# EAGLE board Atx_psu (EAGLE 5.10)
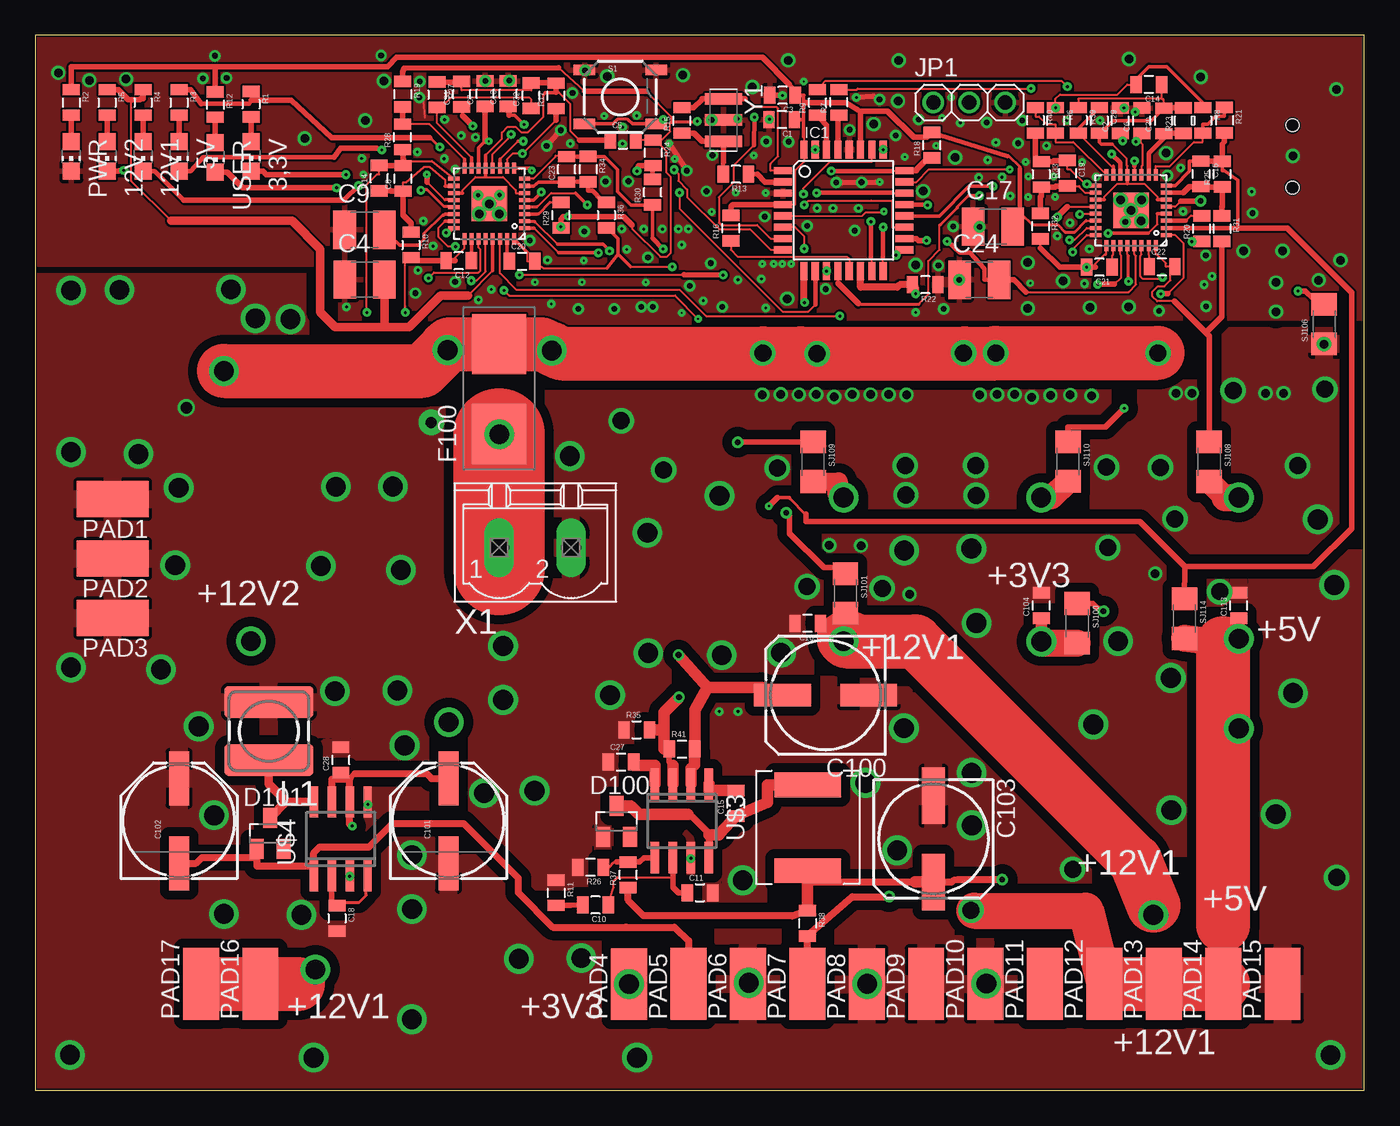
[diagram p6: board, top side]
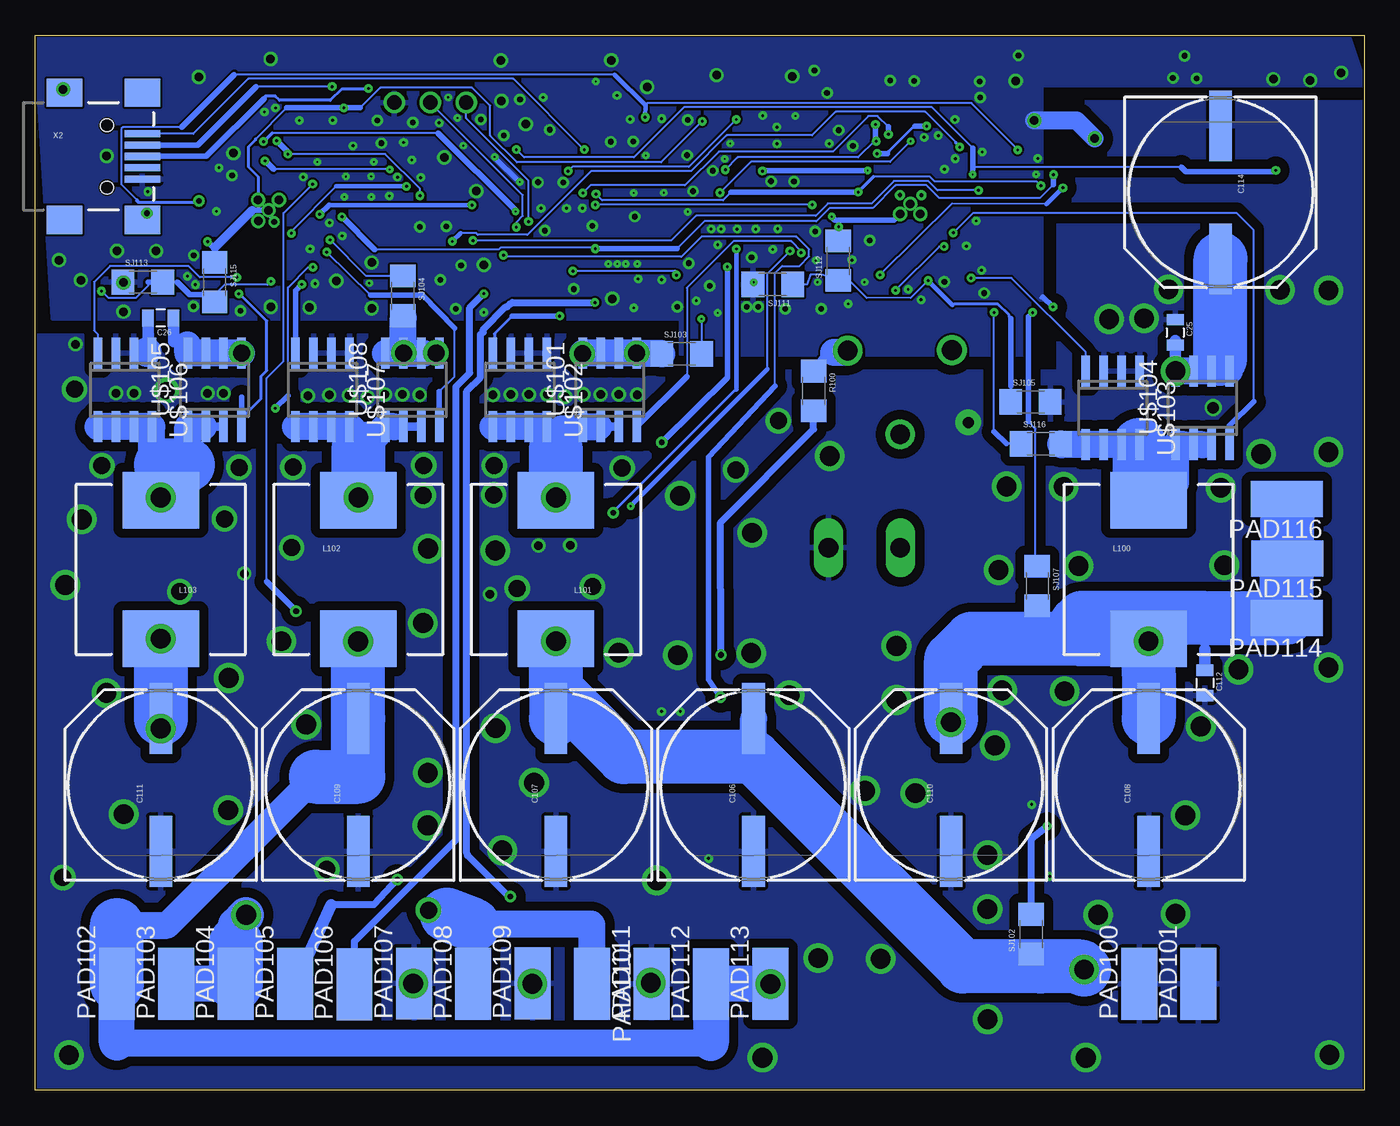
[diagram p7: board, bottom side, seen from below]

Size 93.96 x 74.6 mm. Coordinates in mm from the lower left corner, seen from the top.
Outline: 0,0 93.96,0 93.96,74.6 0,74.6 0,0
Copper layers (1*16): Top 0.035mm / dielectric 1.5mm / Bottom 0.035mm
Design rules "default *": minimum track width 0.2mm, minimum drill 0.2mm, track to track 5mil, track to pad 5mil, pad to pad 5mil, via to via 5mil, smd to smd 5mil, copper to edge 5mil, drill to drill 8mil, minimum pad ring 10mil, minimum via ring 8mil, stop-mask expansion 4mil, vias tented up to drill 0mil, thermal gap 10mil
Net classes: 0 default: width 0.152 mm, drill 0.152 mm, clearance 0.152 mm; 1 power: width 1.905 mm, drill 0.508 mm, clearance 0.66 mm; 2 somepower: width 0.508 mm, drill 0.305 mm, clearance 0.254 mm

## Footprints (pad centres in the part's own frame; a part is rotated, then mirrored left to right if it is on the bottom)
CHIP-LED0805 = smd 1.2 x 1.2: A 0,-1.05; C 0,1.05
0805 = smd 0.8 x 1.2: 1 -0.9,0; 2 0.9,0
C1210 = smd 1.6 x 2.7: 1 -1.4,0; 2 1.4,0
153CLV-0807 = smd 4 x 1.6: + 3.05,0; - -3.05,0
PANASONIC_E = smd 3.8 x 1.4: + 3,0; - -3,0
PANASONIC_H13 = smd 5 x 1.6: + 4.7,0; - -4.7,0
SOT23 = smd 1 x 1.4: 1 -0.95,-1.1; 2 0.95,-1.1; 3 0,1.1
OMNI-BLOK = smd 4.24 x 3.81: 1 0,0; 2 6.37,0
TQFP32-08 = smd 1.27 x 0.508: 1 -4.293,2.8; 2 -4.293,2; 3 -4.293,1.2; 4 -4.293,0.4; 5 -4.293,-0.4; 6 -4.293,-1.2; 7 -4.293,-2; 8 -4.293,-2.8; 17 4.293,-2.8; 18 4.293,-2; 19 4.293,-1.2; 20 4.293,-0.4; 21 4.293,0.4; 22 4.293,1.2; 23 4.293,2; 24 4.293,2.8 | smd 0.508 x 1.27: 9 -2.8,-4.293; 10 -2,-4.293; 11 -1.2,-4.293; 12 -0.4,-4.293; 13 0.4,-4.293; 14 1.2,-4.293; 15 2,-4.293; 16 2.8,-4.293; 25 2.8,4.293; 26 2,4.293; 27 1.2,4.293; 28 0.4,4.293; 29 -0.4,4.293; 30 -1.2,4.293; 31 -2,4.293; 32 -2.8,4.293
1X03 = drill 1.016 round: 1 -2.54,0; 2 0,0; 3 2.54,0
POWER-CHOKE_WE-TPC = smd 6.3 x 2.2: 1 0,2.05; 2 0,-2.05
CDRH125 = smd 5.4 x 4: 1 0,4.9; 2 0,-4.9
SMD2,54-5,08 = smd 2.54 x 5.08: 1 0,0
1206 = smd 1.6 x 1.8: 1 -1.4,0; 2 1.4,0
TACTILE_SWITCH_SMD = smd 1.524 x 0.762: 1 -2.54,1.905; 2 2.54,1.905; 3 -2.54,-1.905; 4 2.54,-1.905
QFN-32 = smd 0.285 x 0.8: P$1 -1.75,-2.5; P$2 -1.25,-2.5; P$3 -0.75,-2.5; P$4 -0.25,-2.5; P$5 0.25,-2.5; P$6 0.75,-2.5; P$7 1.25,-2.5; P$8 1.75,-2.5; P$17 1.75,2.5; P$18 1.25,2.5; P$19 0.75,2.5; P$20 0.25,2.5; P$21 -0.25,2.5; P$22 -0.75,2.5; P$23 -1.25,2.5; P$24 -1.75,2.5 | smd 0.8 x 0.285: P$9 2.5,-1.75; P$10 2.5,-1.25; P$11 2.5,-0.75; P$12 2.5,-0.25; P$13 2.5,0.25; P$14 2.5,0.75; P$15 2.5,1.25; P$16 2.5,1.75; P$25 -2.5,1.75; P$26 -2.5,1.25; P$27 -2.5,0.75; P$28 -2.5,0.25; P$29 -2.5,-0.25; P$30 -2.5,-0.75; P$31 -2.5,-1.25; P$32 -2.5,-1.75 | smd 2.5 x 2.5: P$33 0,0
SO8 = smd 0.6 x 2.2: 1 -1.905,-2.6; 2 -0.635,-2.6; 3 0.635,-2.6; 4 1.905,-2.6; 5 1.905,2.6; 6 0.635,2.6; 7 -0.635,2.6; 8 -1.905,2.6
CR75 = smd 1.75 x 4.7: P$1 0,0; P$2 6.05,0
MSTBV2 = drill 1.397 long: 1 -2.54,0; 2 2.54,0
USB-MINIB = smd 2.5 x 0.5: D+ 2.5,0; D- 2.5,0.8; GND 2.5,-1.6; ID 2.5,-0.8; VBUS 2.5,1.6 | smd 2.5 x 2: GND@1 -3,-4.5; GND@2 -3,4.5; GND@3 2.5,4.5; GND@4 2.5,-4.5 | hole 0.9: 0,2.2; 0,-2.2
CSTCR6M = smd 0.8 x 2.6: 1 -1.5,0; 2 0,0; 3 1.5,0

## Placement (x,y rotation side)
3,3V  YELLOW  [CHIP-LED0805]  15.27,66.04 180 top
5V  YELLOW  [CHIP-LED0805]  10.16,66.04 180 top
12V1  YELLOW  [CHIP-LED0805]  7.62,66.04 180 top
12V2  YELLOW  [CHIP-LED0805]  5.08,66.04 180 top
C1  0,1  [0805]  52.78,68.64 180 top
C2  0,1  [0805]  76.71,68.56 90 top
C3  1u  [0805]  52.84,70.35 180 top
C4  10u  [C1210]  23.28,57.33 0 top
C5  220n  [0805]  41.55,67.19 0 top
C6  0,1  [0805]  78.22,68.56 90 top
C7  0,1  [0805]  31.81,70.47 90 top
C8  0.1  [0805]  26,64.48 90 top
C9  10u  [C1210]  23.27,60.85 0 top
C10  180pF  [0805]  39.6,13.11 180 top
C11  12pF  [0805]  46.99,13.97 0 top
C12  0,1u  [0805]  29.94,58.65 180 top
C13  0,1  [0805]  33.43,70.47 90 top
C14  220n  [0805]  78.74,71.12 180 top
C15  0.1  [0805]  49.53,20.29 90 top
C16  0,1u  [0805]  82.43,64.8 270 top
C17  10uF/6.3V  [C1210]  67.71,61.08 0 top
C18  0,1  [0805]  21.33,12.15 270 top
C19  0,1u  [0805]  72.99,64.85 270 top
C20  0,1u  [0805]  34.41,58.63 0 top
C21  0,1u  [0805]  75.24,58.2 180 top
C22  0,1u  [0805]  79.67,58.24 0 top
C23  0.1  [0805]  37.57,65.12 90 top
C24  10u  [C1210]  66.75,57.31 0 top
C25  0,1u  [0805]  13.36,53.59 270 bottom
C26  220n  [0805]  85.09,54.61 180 bottom
C27  15nF  [0805]  41.41,23.22 0 top
C28  0,1  [0805]  21.6,23.35 90 top
C29  220pF  [0805]  75.23,68.58 270 top
C30  100pF  [0805]  79.78,68.55 90 top
C31  100pf  [0805]  30.15,70.44 90 top
C32  100pf  [0805]  35.05,70.34 90 top
C100  10uF/25V  [153CLV-0807]  55.88,27.94 180 top
C101  68uF/16V  [PANASONIC_E]  29.21,19.05 90 top
C102  68uF/16V  [PANASONIC_E]  10.16,19.05 90 top
C103  47uF/6.3V  [153CLV-0807]  63.5,17.78 270 top
C104  220n  [0805]  71.12,34.29 90 top
C105  220n  [0805]  54.61,33.02 180 top
C106  470u/16V  [PANASONIC_H13]  43.18,21.59 90 bottom
C107  470u/16V  [PANASONIC_H13]  57.15,21.59 90 bottom
C108  470u/16V  [PANASONIC_H13]  15.24,21.59 90 bottom
C109  470u/6.3V  [PANASONIC_H13]  71.12,21.59 90 bottom
C110  470u/16V  [PANASONIC_H13]  29.21,21.59 90 bottom
C111  470u / 6.3V  [PANASONIC_H13]  85.09,21.59 90 bottom
C112  220n  [0805]  11.26,28.81 270 bottom
C113  220n  [0805]  85.09,34.29 90 top
C114  470u  [PANASONIC_H13]  10.16,63.5 270 bottom
D100  BAT54  [SOT23]  41.09,19.01 0 top
D101  SANYO - SBS005-TL-E  [SOT23]  16.6,18.17 0 top
F100  LF 154  [OMNI-BLOK]  32.79,46.39 90 top
IC1  ATMEGA8U2-TQFP  [TQFP32-08]  57.15,62.23 0 top
JP1  [1X03]  66.04,69.85 0 top
L1  47uH, 0.73A, Farnell 744062470  [POWER-CHOKE_WE-TPC]  16.51,25.4 180 top
L100  2,4uH, BOURNS - SRP1235-4R7M  [CDRH125]  15.24,36.83 0 bottom
L101  2,4uH, BOURNS - SRP1235-4R7M  [CDRH125]  57.15,36.83 180 bottom
L102  3,3uH, BOURNS - SRP1235-4R7M  [CDRH125]  71.12,36.83 0 bottom
L103  3,3uH, BOURNS - SRP1235-4R7M  [CDRH125]  85.09,36.83 180 bottom
PAD1  PGND  [SMD2,54-5,08]  5.47,41.8 90 top
PAD2  PGND  [SMD2,54-5,08]  5.47,37.6 90 top
PAD3  PGND  [SMD2,54-5,08]  5.47,33.4 90 top
PAD4  +3,3V  [SMD2,54-5,08]  41.98,7.51 0 top
PAD5  -12V  [SMD2,54-5,08]  46.2,7.52 0 top
PAD6  PGND  [SMD2,54-5,08]  50.39,7.52 0 top
PAD7  ~POWER_ON  [SMD2,54-5,08]  54.59,7.52 0 top
PAD8  PGND  [SMD2,54-5,08]  58.8,7.51 0 top
PAD9  GND  [SMD2,54-5,08]  62.99,7.52 0 top
PAD10  GND  [SMD2,54-5,08]  67.19,7.52 0 top
PAD11  RESERVED  [SMD2,54-5,08]  71.39,7.52 0 top
PAD12  +5V  [SMD2,54-5,08]  75.59,7.52 0 top
PAD13  +5V  [SMD2,54-5,08]  79.79,7.52 0 top
PAD14  +5V  [SMD2,54-5,08]  83.99,7.52 0 top
PAD15  PGND  [SMD2,54-5,08]  88.19,7.52 0 top
PAD16  +12V1  [SMD2,54-5,08]  15.91,7.52 0 top
PAD17  +12V1  [SMD2,54-5,08]  11.71,7.52 0 top
PAD100  PGND  [SMD2,54-5,08]  15.91,7.52 0 bottom
PAD101  PGND  [SMD2,54-5,08]  11.71,7.52 0 bottom
PAD102  +3,3V  [SMD2,54-5,08]  88.19,7.52 0 bottom
PAD103  +12V  [SMD2,54-5,08]  83.99,7.52 0 bottom
PAD104  +12V  [SMD2,54-5,08]  79.79,7.52 0 bottom
PAD105  +5STBY  [SMD2,54-5,08]  75.59,7.53 0 bottom
PAD106  PGOOD  [SMD2,54-5,08]  71.4,7.49 0 bottom
PAD107  PGND  [SMD2,54-5,08]  67.18,7.55 0 bottom
PAD108  +5V  [SMD2,54-5,08]  63,7.53 0 bottom
PAD109  PGND  [SMD2,54-5,08]  58.81,7.56 0 bottom
PAD110  +5V  [SMD2,54-5,08]  54.6,7.53 180 bottom
PAD111  PGND  [SMD2,54-5,08]  50.39,7.53 0 bottom
PAD112  +3,3V  [SMD2,54-5,08]  46.19,7.51 0 bottom
PAD113  +3,3V  [SMD2,54-5,08]  41.99,7.52 0 bottom
PAD114  +12V2  [SMD2,54-5,08]  5.47,33.4 90 bottom
PAD115  +12V2  [SMD2,54-5,08]  5.43,37.6 90 bottom
PAD116  +12V2  [SMD2,54-5,08]  5.47,41.8 90 bottom
PWR  YELLOW  [CHIP-LED0805]  2.54,66.04 180 top
R1  1k  [0805]  15.25,69.72 270 top
R2  1k  [0805]  2.54,69.85 270 top
R3  1k  [0805]  10.16,69.85 270 top
R4  1k  [0805]  7.62,69.85 270 top
R5  1k  [0805]  5.08,69.85 270 top
R6  27k  [0805]  72.14,68.58 270 top
R7  22r  [0805]  56.81,69.86 90 top
R8  30k  [0805]  82.55,68.58 270 top
R9  22r  [0805]  55.31,69.85 90 top
R10  3k16  [0805]  26.57,59.78 270 top
R11  63k4  [0805]  36.83,13.97 270 top
R12  1k  [0805]  12.72,69.71 270 top
R13  27R  [0805]  49.53,64.77 180 top
R14  [0805]  24.31,64.5 90 top
R15  1M  [0805]  45.72,68.58 90 top
R16  10k  [0805]  49.18,60.96 90 top
R17  30k  [0805]  36.81,70.32 90 top
R18  10k  [0805]  63.39,66.83 90 top
R19  10k  [0805]  25.98,70.45 270 top
R20  300k  [0805]  82.47,60.94 90 top
R21  120k  [0805]  84.09,68.61 270 top
R22  1k  [0805]  62.92,56.96 180 top
R23  18k  [0805]  81.19,68.57 90 top
R24  10k  [0805]  43.68,66.29 270 top
R25  [0805]  83.92,64.78 90 top
R26  1k87  [0805]  39.26,15.77 180 top
R27  30k  [0805]  28.4,70.4 270 top
R28  110k  [0805]  25.95,67.41 90 top
R29  300k  [0805]  37.16,61.89 90 top
R30  110k  [0805]  43.65,63.51 90 top
R31  3k16  [0805]  83.91,60.94 270 top
R32  3k16  [0805]  71.07,61.1 270 top
R33  [0805]  71.12,64.77 270 top
R34  [0805]  39.09,65.14 270 top
R35  76k8  [0805]  42.52,25.49 0 top
R36  3k16  [0805]  40.38,61.88 270 top
R37  10k  [0805]  41.91,15.24 90 top
R38  1k  [0805]  54.61,11.81 270 top
R39  12k  [0805]  73.75,68.59 270 top
R40  62k  [0805]  70.71,68.59 270 top
R41  348k  [0805]  45.72,24.13 0 top
R100  0R  [1206]  38.93,49.46 270 bottom
S1  HWB  [TACTILE_SWITCH_SMD]  41.36,70.25 0 top
SJ100  0R  [1206]  73.66,33.02 270 top
SJ101  0R  [1206]  57.28,35.14 270 top
SJ102  0R  [1206]  23.55,11.04 90 bottom
SJ103  0R  [1206]  48.26,52.07 0 bottom
SJ104  0R  [1206]  67.97,56.18 270 bottom
SJ105  0R  [1206]  23.59,48.67 0 bottom
SJ106  0R  [1206]  91.13,54.19 90 top
SJ107  0R  [1206]  23.11,35.66 270 bottom
SJ108  0R  [1206]  83,44.45 270 top
SJ109  0R  [1206]  54.99,44.45 270 top
SJ110  0R  [1206]  73.01,44.46 270 top
SJ111  0R  [1206]  41.82,56.98 180 bottom
SJ112  0R  [1206]  37.19,58.66 90 bottom
SJ113  0R  [1206]  86.36,57.15 0 bottom
SJ114  0R  [1206]  81.25,33.35 270 top
SJ115  0R  [1206]  81.28,57.15 270 bottom
SJ116  0R  [1206]  22.86,45.72 0 bottom
U$1  TPS51222RTVT  [QFN-32]  32.09,62.7 90 top
U$2  TPS51222RTVT  [QFN-32]  77.47,62.23 90 top
U$3  [SO8]  45.72,19.05 180 top
U$4  MAX765CSA  [SO8]  21.59,17.78 0 top
U$100  3,3uH, 5A, EPCOS B82464G4332M , Farnell 7429410  [CR75]  54.61,21.59 270 top
U$101  IRF8252  [SO8]  53.34,49.53 0 bottom
U$102  IRF8252  [SO8]  59.69,49.53 180 bottom
U$103  IRF8252  [SO8]  17.78,48.26 180 bottom
U$104  IRF8252  [SO8]  11.43,48.26 0 bottom
U$105  IRF8252  [SO8]  81.28,49.53 0 bottom
U$106  IRF8252  [SO8]  87.63,49.53 180 bottom
U$107  IRF8252  [SO8]  73.66,49.53 180 bottom
U$108  IRF8252  [SO8]  67.31,49.53 0 bottom
USER  YELLOW  [CHIP-LED0805]  12.73,65.96 180 top
X1  MST2V  [MSTBV2]  35.35,38.37 0 top
X2  USBSMD  [USB-MINIB]  88.9,66.04 0 bottom
Y1  8MHz  [CSTCR6M]  48.66,68.61 270 top

## Tracks (layer width: path | path; a pad name or v marks a point on that pad's centre or on a via)
+3,3V  (via drill 1.4, 1.4 pad 1.8)
  Top 0.8: v71.13,31.73 C104.1
  Top 1.905: SJ100.2 71.15,31.62 71.15,31.9 v71.13,31.73 | v41.98,7.52 42,7.6 PAD4.1
  Bottom 1.905: 74.14,22.18 84.64,11.67 88.19,11.67 | 43.31,7.51 43.29,7.52 PAD113.1 42,7.6 v41.98,7.52 | 46.19,3.36 46.21,3.33 88.16,3.33 88.19,3.37 | L102.2 71.2,32 v71.13,31.73
  Bottom 2.54: 88.19,3.37 PAD102.1 | 43.31,7.51 PAD112.1 46.19,3.36
  Bottom 3.81: PAD102.1 88.19,11.67 | 74.14,22.18 71.12,22.18 C109.+ v71.13,31.73
+3,3V_L  (via drill 0.2 pad 0.61, 0.4 pad 0.61)
  Top 0.152: v74.35,64.08 74.3,64.02 | 74.3,64.02 73.2,65.12 72.99,65.12 C19.1 | 74.3,64.02 74.34,63.98 U$2.P$17 | 72.03,65.75 71.95,65.67
  Top 0.406: SJ100.1 74.79,34.42 75.33,33.88 v75.52,33.88 | 71.95,65.67 R33.1 arc-90 70.71,66.08 R40.2 | C19.1 72.03,65.75
  Bottom 0.152: 77.6,35.96 77.6,50.37 76.41,51.56 76.41,62.03 v74.35,64.08
  Bottom 0.406: v75.52,33.88 77.6,35.96
+5V  (via drill 1.2 pad 0.61, 1.4 pad 1.8)
  Top 0.406: v66.16,12.73 66.37,12.7
  Top 0.8: L103.1 C113.1
  Top 1.905: 76.91,7.52 76.9,7.52 PAD12.1 | PAD13.1 81.11,7.52 | L103.1 84.3,31.93 83.99,31.62 83.79,31.62 SJ114.2 | PAD14.1 83.99,11.67 | v85.09,25.58 85.1,25.6 83.99,25.6
  Top 2.54: 66.37,12.7 74.27,12.7 PAD12.1
  Top 3.81: 76.91,7.52 PAD13.1 | 81.11,7.52 PAD14.1 | 83.99,11.67 83.99,25.6 83.99,31.62
  Bottom 0.406: 64.88,12.41 v66.16,12.73
  Bottom 1.905: PAD110.1 54.6,11.69 54.65,11.74 62.94,11.74 63,11.68 PAD108.1
  Bottom 3.81: L103.1 C111.+ | 63,11.68 64.88,12.41
  other vias: 85.09,31.93
+5V_L  (via drill 0.12, 0.2 pad 0.61)
  Top 0.152: v51.87,41.31 51.98,41.42 | 36.92,59.84 35.28,61.44 | 83.92,66.92 84.09,67.08 | R25.2 83.92,65.7
  Top 0.2: 53.34,41.91 53.4,41.8 54.4,40.8 54.5,40.75
  Top 0.254: 35.28,61.44 U$1.P$2 | 36.92,59.84 40.13,59.85 v40.6,59.35 | 85.02,60.97 85.02,64.36 84.08,65.05 83.92,65.05 R25.2 | U$2.P$8 80.6,63.98 81.6,64.98 81.6,65.7 C16.1 | 52.47,41.91 53.34,41.91
  Top 0.305: 85.02,60.97 U$2.P$2
  Top 0.406: 81.28,37.03 78.08,40.22 54.5,40.22 54.5,40.75 | 81.28,37.03 SJ114.1 | 85.02,60.97 88.51,60.98 93.08,56.42 93.08,39.74 90.37,37.03 81.28,37.03 | 84.09,67.08 R21.2 | 83.92,66.92 83.92,65.7 C16.1 | v51.87,41.31 52.47,41.91
  Bottom 0.152: v40.6,59.35 42.19,57.76 42.19,50.99
  Bottom 0.305: v51.87,41.31 42.19,50.99
+5VSTBY  (via drill 0.4 pad 0.61)
  Top 0.508: U$100.P$2 54.61,14.73 62.19,14.73 | C103.+ 64.81,14.73 64.96,14.88 65.2,14.9 68.1,14.9 v68.37,14.91 68.27,14.88 | 54.61,13.24 R38.1 53.5,12.33 53.47,12.36 42.98,12.36 41.91,13.43 R37.1
  Top 0.813: 54.61,13.24 54.61,14.73 | 62.19,14.73 C103.+
  Bottom 0.508: v68.37,14.91 70.03,13.12 73.05,13.12
  Bottom 0.813: 73.05,13.12 PAD105.1
+12V  (via drill 0.2 pad 0.61)
  Top 0.406: 22.59,22.39 22.18,21.99 21.59,21.99 C28.1
  Top 0.508: U$4.7 20.95,21.99 21.59,21.99 22.23,21.99 U$4.6 22.23,18.77 22.32,18.77 v22.4,18.69 | 22.59,22.39 27.66,22.39 28,22.05 C101.+
  Bottom 0.508: SJ102.2 23.53,17.81 v22.4,18.69
+12V1  (via drill 1.4, 1.4 pad 0.61)
  Top 0.8: L101.1 56.06,33.02 C105.1 56.78,31.75 v57.15,31.75 | 62.23,31.75 SJ101.2
  Top 1.905: 18.57,7.52 18.83,7.26 v19.8,8.53 | 13.03,7.52 PAD17.1 | 79.06,13.04 v79.06,12.39
  Top 3.81: 18.57,7.52 PAD16.1 13.03,7.52 | 79.06,13.04 77.79,16.19 62.23,31.75 57.33,31.75 L101.1
  Bottom 0.406: SJ102.1 23.55,9.45 22.86,8.76
  Bottom 0.8: 57.33,31.75 57.33,32.84 57.15,33.02 v57.15,31.75
  Bottom 1.905: 43.18,23.56 C106.+ | 79.78,11.67 79.79,10.4 | PAD104.1 81.11,7.52 | 57.15,30.4 v57.15,31.75
  Bottom 2.54: v79.06,12.39 79.78,11.67 | 81.11,7.52 PAD103.1
  Bottom 3.81: 57.15,28.35 52.36,23.56 43.18,23.56 28.38,8.76 22.86,8.76 20.02,8.76 v19.8,8.53 | 57.15,28.35 57.15,30.4 | 57.15,28.35 C107.+ | 79.79,10.4 PAD104.1 | 57.33,31.75 L101.1
+12V1_L  (via drill 0.2 pad 0.61, 0.4 pad 0.61)
  Top 0.152: 56.98,36.96 SJ101.1 | U$1.P$8 35.22,64.45 36.77,66 36.77,66.08 C23.2 38.21,66.08 38.26,66.04
  Top 0.254: 43.65,60.25 R30.1 42.13,62.61 41.18,63.56 41.18,65.11 40.25,66.04 R34.1
  Top 0.305: v44.39,59.5 43.65,60.25 | R34.1 38.26,66.04
  Top 0.406: 56.98,36.96 55.75,36.96 53.34,39.37 53.34,40.6 v53.1,40.84
  Bottom 0.2: v53.1,40.84 53.1,40.9 44.5,49.5 44.39,49.55
  Bottom 0.305: 44.39,49.55 v44.39,59.5
+12V2  (via drill 1.4)
  Bottom 0.6: C112.1 11.26,33.23 11.43,33.4
  Bottom 0.8: C112.1 11.26,31.17 | SJ107.2 23.11,32.18 22.86,31.93
  Bottom 1.905: PAD114.1 5.47,34.84 6.13,34.84 | 5.43,40.48 5.47,40.52 PAD116.1 | 5.47,36.28 5.43,36.32 PAD115.1 | 15.03,29.71 15.24,29.93 15.24,29.52 | L100.2 v15.24,31.75 15.24,30.4 | 29.21,30.4 27.86,30.4 | v29.23,26.03 29.3,25.4 C110.+ 29.3,28.6 29.21,30.48
  Bottom 3.81: 5.47,34.84 5.47,36.28 | PAD115.1 5.43,40.48 | 15.24,30.4 15.24,29.93 | 15.24,29.52 C108.+ | C110.+ 29.21,30.4 | 20.32,31.93 L100.2 | 20.32,31.93 22.86,31.93 27.76,31.93 29.21,30.48 | PAD114.1 11.43,33.4 19.94,33.4 20.32,33.02 20.32,31.93
+12V2_L  (via drill 0.2 pad 0.61)
  Top 0.152: U$1.P$17 28.05,65.71 26.17,65.71 R28.1 25.95,66.42 26,66.37 | v23.44,55 23.44,64.06 24.16,64.77 24.31,64.77 R14.2
  Top 0.406: R14.2 25.98,65.4 | 25.98,65.4 C8.2 | 26,66.37 26,65.4 25.98,65.4
  Bottom 0.152: 23.75,47.28 23.23,46.76 23.23,37.09 22.86,36.72 SJ107.1 | 23.75,54.7 v23.44,55
  Bottom 0.406: 23.75,47.28 23.75,54.7
-12V
  Top 0.508: C102.- 11.37,16.05 11.78,16.47 15.65,16.47 | 15.65,16.47 15.65,15.86 19.56,15.86 19.68,15.98 | 15.65,16.47 D101.1 | 19.68,15.98 19.68,16.79 20.09,17.2 23.6,17.2 25.27,18.86 30.29,18.86 34.13,15.02 34.13,13.98 36.59,11.53 41.72,11.53 41.82,11.53 45.19,11.53 46.2,10.57 PAD5.1 | 19.68,15.98 U$4.1
AGND  (via drill 0.12, 0.2 pad 0.61, 0.3 pad 0.61, 0.4 pad 0.61, 0.6 pad 0.61)
  Top 0.152: U$1.P$33 32.85,63.46 v32.82,63.31 | 43.17,70.64 44.98,68.83 44.98,68.45 44.89,68.36 44.89,67.8 44.08,66.98 | 38.83,70.64 37.01,72.29 | 44.08,66.98 44.64,66.43 44.64,64.88 44.93,64.58 44.93,59.22 44.65,58.94 44.2,58.94 42.19,60.95 42.19,61.18 | R24.1 | 44.08,66.98 43.87,67.19 R24.1 | R24.1 C5.2 | 25.98,71.66 R19.1 | v81.78,60.01 82.5,60.01 R20.1 | C14.2 77.21,71.12 76.51,70.42 72.45,70.42 72.14,70.11 R6.1 | v78.21,62.96 v78.21,61.49 v78.2,61.48
  Top 0.2: U$1.P$33 v32.09,62.69 | v37.16,61.07 37.2,61.1 R29.1 | 44.98,68.45 45,68.5 46.8,68.5 v46.8,68.53
  Top 0.254: R8.1 82.55,69.85 80.01,72.39 78.74,72.39 77.84,71.49 C14.2
  Top 0.406: 43.17,70.64 38.83,70.64 | 37.01,72.29 26.09,72.28 25.98,71.98 25.98,71.66 | 42.19,61.18 41.59,61.78 v37.66,61.78 37.33,61.78 37.16,61.62 R29.1 | v31.31,63.29 v32.81,61.97 v32.09,62.69 | U$1.P$33 v31.38,61.97 | v76.74,62.96 | U$2.P$33 v76.74,62.96
  Bottom 0.152: 37.19,61.55 37.42,61.55 | 70.99,69.48 69.58,70.89 63.06,70.89 61.8,69.63 61.8,67.51 59.91,65.61 49.72,65.61 v46.8,68.53 | 76.18,69.48 78.39,67.27 | 37.19,60.94 SJ112.2 | 78.61,62.24 78.39,62.24 78.23,62.24 78.21,62.23 v78.21,62.96 | 77.48,62.24 U$2.P$33 | 81.28,59.58 81.35,59.58
  Bottom 0.2: v77.08,61.4 77.1,61.5 77.7,62.1 U$2.P$33 | v78.21,62.96 78.2,63 78.2,64.6 78.9,65.3 78.9,66.7 78.4,67.2 78.39,67.27
  Bottom 0.406: 37.42,61.55 v37.66,61.78 | 37.19,60.94 37.19,61.55 33.24,61.55 v32.81,61.97 | 70.99,69.48 R6.1 76.18,69.48 | 78.39,62.24 77.48,62.24 | 81.35,59.58 v81.78,60.01 | 81.28,59.58 SJ115.1
  Bottom 0.61: 78.61,62.24 81.28,59.58
  other vias: 77.47,62.23 72.14,69.48
COMP1_A
  Top 0.152: 79.78,67.34 C30.1 80.34,67.65 80.36,67.67
  Top 0.305: U$2.P$10 78.72,66.28 79.78,67.34
  Top 0.406: 80.36,67.67 R23.1
COMP1_B  (via drill 0.2 pad 0.61)
  Top 0.152: U$1.P$10 33.34,65.83 33.75,66.24 v34.44,66.24 36.81,68.61 | C31.1 30.15,68.91 30.21,68.91
  Top 0.406: 30.21,68.91 v30.93,68.18 | 36.81,68.61 R17.1
  Bottom 0.2: 31.77,68.18 31.9,68.1 33.6,66.4 33.71,66.24
  Bottom 0.406: 33.71,66.24 v34.44,66.24 | v30.93,68.18 31.77,68.18
COMP2_A
  Top 0.152: R39.2 76.08,65.36 76.22,65.36
  Top 0.254: 76.22,65.36 U$2.P$15 | R39.2 73.75,68 C29.1
COMP2_B
  Top 0.152: C32.1 35.05,70.07 34.9,70.22 29.43,70.22 28.4,69.19 | 28.4,69.19 28.4,68.4 30.84,65.95 | 28.4,69.19 R27.2
  Top 0.254: U$1.P$15 30.84,65.95
CSP1_A
  Top 0.152: 83.92,62.48 83.91,62.47 | C16.2 83.07,63.9 83.1,63.88
  Top 0.305: U$2.P$7 81.18,63.48
  Top 0.406: C16.2 81.6,63.9 81.18,63.48 | 83.91,62.47 R31.1 | 83.1,63.88 R25.1 83.92,62.48
CSP1_B
  Top 0.152: 38.26,64.24 38.21,64.28 C23.1 | 40.05,62.95 R36.1
  Top 0.254: U$1.P$7 35.22,63.95 35.58,64.22 C23.1
  Top 0.305: 38.26,64.24 R34.2 39.09,63.61 39.4,63.61 40.05,62.95
CSP2_A
  Top 0.152: 71.07,63.19 71.12,63.24 | U$2.P$18 74.2,63.48 73.82,63.87 73.82,63.95 C19.2 | 72.08,63.87 72.16,63.95
  Top 0.406: 71.12,63.24 R33.2 72.08,63.87 | R32.1 71.07,63.19 | 72.16,63.95 C19.2
CSP2_B
  Top 0.152: C8.1 26,64.21 26.22,64.21 27.48,65.31 27.88,65.31 28.96,64.39 28.96,63.95 | 25.16,63.58 25.14,63.6
  Top 0.254: 28.96,63.95 U$1.P$18
  Top 0.406: R10.1 26.57,61.31 26,61.88 C8.1 25.16,63.58 | 25.14,63.6 R14.1
D+  (via drill 0.2 pad 0.61)
  Top 0.152: R7.2 58.06,70.76 58.15,70.84 v70.4,70.84
  Bottom 0.2: v70.4,70.84 70.5,70.8 72.3,70.8 73.1,70 76.7,70 77,70.3 77.7,70.3 77.78,70.13
  Bottom 0.406: X2.D+ 81.87,66.04 77.78,70.13
D-  (via drill 0.2 pad 0.61)
  Top 0.152: R9.2 55.88,71.38 55.89,71.39 72.56,71.39 v72.97,70.97
  Bottom 0.152: v72.97,70.97 78.35,70.97
  Bottom 0.406: X2.D- 82.48,66.84 78.35,70.97
DRVH1_A  (via drill 0.2 pad 0.61)
  Top 0.152: U$2.P$1 80.6,60.48 81.2,59.88 81.2,57.45 80.06,56.32
  Top 0.406: v79.58,56.32 80.06,56.32
  Bottom 0.152: U$105.4 79.38,48.26
  Bottom 0.2: v79.58,56.32 79.5,56.3 77.6,54.4 77.6,50.9 78,50.5 78,48.9 79.3,47.6 U$105.4
  Bottom 0.406: 79.38,48.26 79.38,49.02
DRVH1_B  (via drill 0.2 pad 0.61)
  Top 0.152: 35.27,60.95 37,59.23
  Top 0.254: 37,59.23 v39.82,59.23 | U$1.P$1 35.27,60.95
  Bottom 0.152: 47.89,50.48 47.89,56.76 44.61,60.04 40.51,60.04 39.82,59.35 v39.82,59.23
  Bottom 0.406: 47.89,50.48 U$101.4
DRVH2_A  (via drill 0.2 pad 0.61)
  Top 0.152: v73.36,59.28 73.36,59.5 74.34,60.48 U$2.P$24
  Bottom 0.152: 70.24,56.23 v73.36,59.28 | 64.33,53.9 64.33,50.48 65.41,49.4 | U$108.4 65.41,48.26
  Bottom 0.406: 70.24,56.23 66.59,56.23 64.33,53.9 | 65.41,48.26 65.41,49.4
DRVH2_B  (via drill 0.2 pad 0.61)
  Top 0.152: v29.05,60.64 29.29,60.64 U$1.P$24
  Bottom 0.152: U$104.4 9.53,46.99 | 7.81,48.7 7.81,60.83 9.02,62.04 27.66,62.04 v29.05,60.64
  Bottom 0.406: 9.53,46.99 7.81,48.7
DRVL1_A  (via drill 0.2 pad 0.61)
  Top 0.152: v79.71,57.49 79.61,57.39 78.29,57.39 78.14,57.55 78.14,59.02 78.22,59.1 U$2.P$30
  Bottom 0.152: U$106.4 89.53,53.46 89.81,53.74 89.81,57.16 88.68,58.29 83.12,58.29 82.32,57.49 v79.71,57.49
DRVL1_B  (via drill 0.2 pad 0.61)
  Top 0.152: v56.88,54.75 56.82,54.75 47.43,54.75 45.56,56.62 33.99,56.61 32.85,57.78 U$1.P$30
  Bottom 0.2: U$102.4 61.5,52.2 61.5,53.5 60.4,54.6 60.26,54.74
  Bottom 0.406: v56.88,54.75 60.26,54.74
DRVL2_A  (via drill 0.2 pad 0.61)
  Top 0.152: U$2.P$27 76.72,59.1 76.78,59.04 76.78,57.48 76.29,56.99
  Top 0.406: v75.12,56.99 76.29,56.99
  Bottom 0.406: U$107.4 75.56,56.55 v75.12,56.99
DRVL2_B  (via drill 0.2 pad 0.61)
  Top 0.152: U$1.P$27 31.34,59.57 31.47,59.45 31.47,57.96 31.33,57.83 28.18,57.83 v27.8,57.44
  Bottom 0.152: U$103.4 19.68,52.19 24.94,57.44 v27.8,57.44
ENABLE_3V  (via drill 0.2 pad 0.61)
  Top 0.152: 63.06,62.63 v63.09,62.6 | v73.85,61.95 73.89,61.98 U$2.P$21
  Top 0.305: IC1.21 63.06,62.63
  Bottom 0.305: v63.09,62.6 73.2,62.6
  Bottom 0.406: 73.2,62.6 v73.85,61.95
ENABLE_5V  (via drill 0.2 pad 0.61)
  Top 0.152: 78.7,60.6 79.34,61.25 79.34,61.98
  Top 0.254: IC1.20 63.93,61.83 66.03,63.93 v67.72,63.93 | 79.34,61.98 U$2.P$4 | v75.85,60.6 78.7,60.6
  Bottom 0.152: v75.85,60.6 75.85,60.75 72.68,63.93
  Bottom 0.305: v67.72,63.93 72.68,63.93
ENABLE_5VSTBY  (via drill 0.2 pad 0.61, 0.4 pad 0.61)
  Top 0.152: v60.86,59.06 61.07,59.06 IC1.17 | v45.51,27.8 45.51,27.79
  Top 0.406: 45.09,22.98 44.82,23.24 R41.1
  Top 0.813: U$3.3 45.09,22.98 | R41.1 44.45,24.13 44.45,25.4 | 44.45,25.4 44.45,26.73 v45.51,27.8 | R35.2 44.36,25.49 44.45,25.4
  Bottom 0.152: v60.86,59.06 60.74,58.94 48.28,58.94 46.86,60.36 40.14,60.36 39.25,59.47 39.25,58.98 39.93,58.29 41.16,58.29 41.66,57.79 41.66,49.79
  Bottom 0.406: 41.66,49.79 46.34,44.78 46.37,29.04 v45.51,27.8
ENABLE_12V1  (via drill 0.2 pad 0.61)
  Top 0.125: 60.58,61.03 60.58,62.91 59.1,62.91
  Top 0.152: 60.58,61.03 IC1.19 | v54.36,62.62 54.68,62.91 59.1,62.91 | 35.47,62.45 35.51,62.49 36.48,63.46 38.19,63.46
  Top 0.2: U$1.P$4 34.6,62.5 35.5,62.5 35.51,62.49
  Top 0.254: 38.19,63.46 v39.03,62.62
  Bottom 0.152: v39.03,62.62 v54.36,62.62
ENABLE_12V2  (via drill 0.2 pad 0.61)
  Top 0.152: 62.45,60.09 62.31,60.23
  Top 0.2: U$1.P$21 29.5,62.5 28.9,62.5 27.7,63.7 27.3,63.7 v27.27,63.64
  Top 0.406: v63.01,60.09 62.45,60.09 | 62.31,60.23 IC1.18
  Bottom 0.152: v63.01,60.09 49.01,60.09 47.25,61.85 38.77,61.85 37.93,62.7 34.85,62.7 33.26,64.29 30.82,64.29 30.16,63.64 v27.27,63.64
ENABLE_A  (via drill 0.12, 0.2 pad 0.61)
  Top 0.152: v68.91,65.12 63.2,65.12 62.31,64.23 IC1.23 | U$2.P$12 77.72,65.36
  Top 0.305: v77.72,65.72 77.72,65.36
  Bottom 0.152: v68.91,65.12 77.12,65.12
  Bottom 0.406: 77.12,65.12 v77.72,65.72
ENABLE_B  (via drill 0.2 pad 0.61)
  Top 0.152: U$1.P$12 32.34,66.2 33.64,67.5 v33.64,67.6 | IC1.22 60.58,63.43 60.55,63.46
  Top 0.305: v55.24,63.46 60.55,63.46
  Bottom 0.152: v55.24,63.46 54.72,63.99 48.03,63.99 45.63,66.39 37.55,66.39 35.05,68.89 34.4,68.89 33.64,68.13
  Bottom 0.406: v33.64,67.6 33.64,68.13
GND  (via drill 0.12, 0.2, 0.4, 0.6)
  Top 0.152: 27.54,68.8 27.43,69.94 v27.16,70.22
  Top 0.154: C6.2 78.05,69.46 v77.77,69.18
  Top 0.2: C13.2 33.6,71.4 v33.51,71.4 | C2.2 76.8,69.5 v76.98,69.47 | S1.1 38.8,72.2 v38.87,72.11
  Top 0.406: v36.15,66.78 v37.15,67.89 | v58.05,70.21 59.27,70.29 | v46.07,65.03 v44.83,66.95 | v49.68,68.71 v47.83,68.61 Y1.2 | C3.2 v52.83,70.35 | v56.63,64.19 56.99,64.19 v59.71,64.23
  Bottom 0.2: 22.7,56.1 22.86,56.05
  Bottom 0.406: v59.71,64.23 61.48,65.94 v61.48,66 | v22,55.4 22.7,56.1
  Bottom 1.27: v19.05,67.31 20.32,68.58 v23.32,68.58
  other vias: 88.92,66.08 85.42,59.35 40.44,71.71 59.27,68.33 3.81,71.43 1.62,71.95 43.32,58.89 70.18,55.3 53.17,55.98 69.5,66.97 79.96,66.27 87.72,55.06 87.74,57.12 77.32,55.4 74.57,55.35 72.67,57.24 70.17,58.54 62.25,58.36 57.93,60.79 42.84,55.41 48.56,55.39 51.64,55.33 46.27,56.88 36.48,55.62 47.46,63.58 51.56,61.78 40.32,64.28 58.42,64.21 51.67,67.11 53.26,67.08 50.71,70.94 61,69.97 62.46,68.66 67.27,68.44 57.57,67.92 45.7,59.79 51.65,63.46 47.88,66.13 68.93,63.25 80.05,64.7 81.16,62.16 86.01,63.54 83.21,57.56 79.46,55.11 55.89,56.66 64.24,55.25 62.24,55.02 53.45,58.44 46.18,60.91 43.02,60.91 44.34,60.91 82.41,71.66 65.4,68.42 69.77,68.58 29.68,57.16 31.33,55.9 34.97,60.1 29.68,65.13 31.12,67.39 42.53,68.92 40.22,68.91 37.98,70.54 47.83,62.13 38.81,60.73 50.79,66.11 31.81,71.37 26.87,56.37 32.24,56.64 27.06,57.99 40.93,55.25 38.39,55.25 43.65,55.41 47.76,58.49 49.68,57.32 47.23,55.84 35.33,57.15 27.43,61.48 54.59,61.13 64.9,61.08 66.71,64.54 70.2,63.17 70.22,64.62 70.03,65.64 71.5,66.79 74.03,65.65 75.02,64.58 72.01,64.61 72.11,63.18 72.26,60.42 74.53,59.5 55.27,62.38 58.2,62.38 56.4,62.37 63.86,58.34 82.76,59.03 67.92,67.03 67.33,65.79 92.28,58.7 88.19,59.36 45.7,54.98 38.65,57.15 38.78,58.67 27.2,71.34 23.07,65.89 28.94,68.64 27.01,66.36 90.75,57.28 41.47,60.92 43.17,57.14 82.78,55.44 92,70.79 80.98,65.24 23.19,64.76 6.42,71.5 24.64,71.37 70.36,57.08 68.35,64.58 74.18,57.04 66.76,61.06 60.82,67.53 59.69,70.07 86.07,62.03 53.23,72.84 45.79,71.79 62.78,63.58 65.03,65.97 24.45,73.17 12.7,73.15 11.86,71.56 13.52,71.58 41.82,59.46 51.34,57.38 61.04,72.82 30.11,67.51 45.47,60.92 65.33,57.32 72.93,68.59 63.69,66.8 64.77,70.22 64.11,68.76 49.52,63.48 45.21,65.87 37.83,66.95 51.91,68.66 54.32,71.34 36.22,58.71 75.29,68.58 77.33,72.93 41.52,66.93 41.53,68.11 41.94,64.28 28.12,59.7 52.82,58.44 52.21,58.44 51.39,58.44 73.16,61.34 28.91,65.88 82.66,56.98
  pour Top: 0,74.93 93.98,74.93 93.98,54.61 46.99,54.61 46.99,52.07 21.59,52.07 21.59,58.42 0,58.42
  pour Bottom: 1.27,74.93 93.98,74.93 92.71,54.61 48.26,54.61 48.26,52.07 22.86,52.07 22.86,71.12 0,71.12
HWB
  Top 0.152: IC1.13 57.55,58.8 57.41,58.95 49.66,58.95 49.18,59.43 R16.1
IMON1_A  (via drill 0.12, 0.2 pad 0.61)
  Top 0.125: 58.72,62.09 59.88,62.09
  Top 0.152: 58.72,62.09 58.47,61.84 IC1.5 | 78.13,67.35 78.08,67.35 v77.82,67.09 | 78.13,67.35 78.13,67.04 78.28,66.89 78.28,65.42 78.22,65.36 U$2.P$11 | 78.13,67.35 C6.1
  Top 0.2: 60.02,62.24 v60,62.15
  Top 0.254: 59.88,62.09 60.02,62.24
  Bottom 0.152: 65.47,67.69 77.22,67.69
  Bottom 0.2: v60,62.15 60.04,62.26
  Bottom 0.254: 77.22,67.69 v77.82,67.09
  Bottom 0.406: 60.02,62.24 60.04,62.26 65.47,67.69
IMON1_B  (via drill 0.2 pad 0.61)
  Top 0.152: 32.84,65.83 34.13,67.12 | v45.17,65.1 45.46,64.81 45.46,64.31 45.47,64.31 46.08,63.7 46.08,63.16 48.36,60.88 50.54,60.88 51.99,59.43 IC1.8
  Top 0.254: U$1.P$11 32.84,65.83 | 34.13,67.12 v34.51,67.12 | 33.51,68.97 33.89,68.97 v34.56,68.3
  Top 0.406: 33.51,68.97 C13.1
  Bottom 0.152: v34.51,67.12 34.57,67.18 | 34.57,67.18 34.56,67.2 | v45.17,65.1 44.3,65.97 35.79,65.97 34.57,67.18
  Bottom 0.406: 34.56,67.2 v34.56,68.3
IMON2_A  (via drill 0.2 pad 0.61)
  Top 0.152: 56.75,57.07 IC1.12 | 63.94,61.19 63.94,59.45 63.15,58.65 63.15,56.3 62.48,55.63 | v76.89,67.15 76.71,67.33 C2.1
  Top 0.2: 58.2,55.63 58.3,55.6 62.5,55.6 62.48,55.63 | 63.94,61.19 64,61.2 65.2,62.4 65.2,62.5 66,63.3 66.02,63.27
  Top 0.254: 66.02,63.27 v66.76,63.27
  Top 0.305: v76.1,66.2 76.72,65.58 U$2.P$14
  Top 0.406: 58.2,55.63 56.75,57.07
  Bottom 0.152: v66.76,63.27 66.76,63.74 69.22,66.2 v76.1,66.2 76.1,66.35
  Bottom 0.406: 76.1,66.35 v76.89,67.15
IMON2_B  (via drill 0.12, 0.2 pad 0.61)
  Top 0.152: v45.55,63.48 45.55,62.34 52.82,55.07 54.66,55.07 55.15,55.56
  Top 0.254: U$1.P$14 31.34,66.65 31.81,67.11
  Top 0.305: 55.15,55.56 IC1.10
  Top 0.406: C7.1 31.81,67.11 v32.07,67.11
  Bottom 0.152: v32.07,67.11 33.52,65.66 43.36,65.66 v45.55,63.48
LED  (via drill 0.2 pad 0.61)
  Top 0.152: v34.23,57.67 45.86,57.67
  Top 0.406: USER.C 13.55,64.91 14.64,63.82 v21.31,63.82 | 45.86,57.67 v48.63,57.65
  Bottom 0.152: 48.77,57.92 IC1.11 | 22.46,62.67 29.15,62.7 v34.23,57.67
  Bottom 0.2: 48.77,57.92 48.7,57.9 48.7,57.7 v48.63,57.65
  Bottom 0.305: v21.31,63.82 22.46,62.67
  other vias: 55.95,57.94
MOSI  (via drill 0.2 pad 0.61)
  Top 0.152: IC1.16 59.95,58.8
  Top 0.305: 59.95,58.8 v59.95,61.04
  Bottom 0.152: JP1.2 59.49,63.3 59.49,61.84 59.95,61.38 v59.95,61.04 | v59.95,61.04
N$1  (via drill 0.2 pad 0.61)
  Top 0.152: 77.3,59.02 77.22,59.1 U$2.P$28
  Top 0.2: 77.3,59.02 77.3,59 77.3,57.3 v77.3,57.2
  Top 0.406: v89.28,56.51 89.81,56.51 90.31,56.01 SJ106.2
  Bottom 0.152: v77.3,57.2 77.55,56.96 80.59,56.96 81.28,56.26 SJ115.2 | 83.93,57.15 SJ113.2 | 85.99,57.15 85.99,56.89 86.86,56.02 88.79,56.02 v89.28,56.51
  Bottom 0.406: SJ113.2 85.99,57.15 | 81.28,56.26 83.05,56.26 83.93,57.15
N$2  (via drill 1.4 pad 1.8)
  Top 1.676: v71.12,41.91 71.86,41.91 SJ110.2
  Bottom 0.6: 68.58,46.93 U$108.2 U$108.3
  Bottom 1.905: 71.12,46.3 U$107.8 U$107.7 U$107.6 U$107.5 | 68.58,46.93 U$108.1 69.85,46.3 71.12,46.3 | 71.12,46.3 71.12,45.34
  Bottom 3.81: 71.12,45.34 v71.12,41.91 L102.1
N$3
  Top 0.152: R8.2 82.55,67.05 81.92,67.05 80.23,65.36 79.22,65.36 U$2.P$9
  Top 0.254: R21.1 84.09,68.88 83.46,68.88 82.89,68.31 82.55,68.31 R8.2
N$4
  Top 0.152: R40.1 70.71,68.86 70.97,68.86 71.51,68.31 72.14,68.31 R6.2 72.14,67.05 73.4,67.05 U$2.P$16
N$5
  Top 0.152: 20.95,13.3 21.21,13.05 C18.1
  Top 0.2: 21.1,13.3 C18.1 21.2,13.3 22.9,13.3 23.4,13.8 23.4,15.1 U$4.4
  Top 0.406: 20.95,13.3 U$4.2
N$6
  Top 0.6: D101.3 17.71,20.38 17.78,20.38 | 17.78,20.38 U$4.8 | L1.1 16.51,21.65 17.78,20.38
N$7
  Top 0.406: PWR.A R2.2
N$8  (via drill 1.4 pad 1.8)
  Top 1.676: SJ108.2 84.13,41.91
  Top 1.905: 84.13,41.91 v85.09,41.91
  Bottom 0.6: U$105.3 U$105.2 82.07,46.93 | 82.55,46.93 82.23,46.93
  Bottom 1.905: 83.19,44.22 U$105.1 82.55,46.93 | U$106.5 U$106.6 U$106.7 U$106.8 85.72,44.22 85.09,44.22 v85.09,41.91 L103.2 | 82.23,46.93 82.07,46.93
  Bottom 3.81: 85.09,44.22 83.19,44.22
N$9
  Top 0.152: 15.27,68.18 15.25,68.19
  Top 0.406: 15.25,68.19 R1.2 | 3,3V.A 15.27,68.18
N$10
  Top 0.406: 5V.A R3.2
N$11
  Top 0.406: 12V1.A R4.2
N$12
  Top 0.152: R29.2 36.4,62.79 36.33,62.79
  Top 0.2: 35.49,61.95 35.6,62 36.4,62.8 36.4,62.79
  Top 0.254: U$1.P$3 35.49,61.95
N$13
  Top 0.254: 33.34,58.63 U$1.P$31
  Top 0.305: C20.1 33.34,58.63
N$14
  Top 0.406: 12V2.A R5.2
N$15
  Top 0.152: 30.84,59.48 30.84,59.49
  Top 0.254: C12.1 30.84,59.48 | 30.84,59.49 U$1.P$26
N$16
  Top 0.406: 32.79,36.83 X1.1
  Top 6.452: 32.79,36.83 F100.1
N$17  (via drill 1.4)
  other vias: 32.8,46.39
N$19  (via drill 1.4 pad 1.8)
  Top 1.27: SJ109.2 56.81,43.05 56.81,42.26
  Top 1.676: 56.81,42.26 v57.15,41.91
  Bottom 0.6: 54.61,46.93 54.29,46.93 | 58.1,46.93 U$102.8 56.89,46.93 56.75,46.78 | 54.13,46.93 U$101.2 U$101.3
  Bottom 1.905: U$102.5 U$102.6 U$102.7 58.1,46.93 | 54.61,46.93 U$101.1 55.39,46.78 56.75,46.78 56.75,45.75 57.15,45.34 | 54.29,46.93 54.13,46.93
  Bottom 3.81: 57.15,45.34 v57.15,41.91 L101.2
N$20
  Top 0.152: 42.29,22.98 42.17,22.86
  Top 0.406: 42.17,22.86 C27.2
  Top 0.813: U$3.4 43.81,22.98 42.29,22.98
N$22
  Top 0.508: U$3.8 47.62,18.06 47.4,18.4 46.5,19.3 46.16,19.52 | 48.33,18.06 48.42,18.15
  Top 0.813: D100.3 42.1,20.11 42.69,19.52 46.16,19.52 | 48.42,18.15 C15.1 51.75,20.37 51.75,21.59 U$100.P$1 | 47.62,18.06 48.33,18.06
N$24
  Top 0.152: R20.2 81.72,61.86 81.34,61.48
  Top 0.305: U$2.P$3 81.34,61.48
N$25
  Top 0.305: R13.1 51.06,64.77
  Top 0.406: 51.06,64.77 51.6,64.23 IC1.2
N$28
  Top 0.152: 45.09,15.07 41.16,15.07 40.9,14.81 40.9,14.34 C10.1
  Top 0.406: C11.1 45.46,13.97 45.09,14.35 45.09,15.07 U$3.6
N$29
  Top 0.152: C22.1 78.77,59.07 78.75,59.07 78.72,59.1 U$2.P$31
N$30
  Top 0.152: C21.1 76.14,59.03 76.22,59.1 U$2.P$26
N$31
  Top 0.406: R11.2 37.83,13.07 C10.2
N$33
  Bottom 0.6: U$104.3 11.44,45.66 | U$104.2 12.7,45.66
  Bottom 1.905: 15.24,42.95 15.88,42.95 | 15.24,42.95 13.34,42.95 U$104.1 12.7,45.66 | 15.24,42.95 L100.1 | 11.44,45.66 U$104.2 | U$103.8 U$103.7 U$103.6 U$103.5 21.4,45.66 SJ116.2
  Bottom 3.81: 15.88,42.95 U$103.8
N$35
  Top 0.813: C15.2 47.62,21.19 U$3.1
N$36
  Top 0.152: 12.72,68.18
  Top 0.406: 12.72,68.18 R12.2 | USER.A 12.72,68.18
N$41  (via drill 0.12, 0.2)
  Top 0.152: R24.2 43.68,65.07 43.65,65.04 | 35.13,65.21 v35.11,65.05
  Top 0.254: U$1.P$9 34.18,65.21 35.13,65.21
  Top 0.305: 43.65,65.04 R30.2
  Top 0.406: R24.2 42.65,65.39 v42.54,65
  Bottom 0.152: 42.65,65.05 v42.54,65
  Bottom 0.406: v35.11,65.05 42.65,65.05
N$42
  Top 0.152: 30.34,65.83 27.86,68.31 R28.2
  Top 0.254: U$1.P$16 30.34,65.83
  Top 0.406: R19.2 25.98,68.31 R28.2
N$43
  Top 0.152: 41.08,16.14 41.08,16.12
  Top 0.2: R26.1 40.2,15.8 40.6,15.8 40.9,16.1 41.08,16.14
  Top 0.406: U$3.5 43.05,16.45 42.74,16.14 R37.2 41.08,16.14
N$61  (via drill 0.2 pad 0.61)
  Top 0.152: v30.83,57.26 31.2,57.26 31.84,57.9 U$1.P$28
  Bottom 0.152: v30.83,57.26 32.05,56.04 35.17,56.03 36.39,57.26 SJ112.1 38.35,57.68 39.15,57.68 39.39,56.98 SJ111.1 | SJ105.1 24.99,49.8
  Bottom 0.2: 24.99,54.58 25.1,54.7 25.1,54.8 25.9,55.6 29,55.6 29.11,55.54
  Bottom 0.305: 29.11,55.54 v30.83,57.26
  Bottom 0.406: 24.99,49.8 24.99,54.58
PGND  (via drill 0.2, 0.6, 0.6 pad 0.25, 0.6 pad 1.01, 0.8, 0.8 pad 1.8, 1.2 pad 1.01, 1.2 pad 1.8, 1.4, 1.4 pad 1.8)
  Top 0.152: v52.72,30.94 52.05,31.73
  Top 0.406: v23.52,20.21 23.52,20.36 U$4.5 | v22.23,15.13 22.23,15.16 U$4.3 | U$3.7 46.35,16.41 v46.35,16.39
  Top 1.905: v58.82,7.53 58.9,7.6 PAD8.1 | v67.24,7.55 67.3,7.6 PAD10.1
  Bottom 0.406: PAD107.1 PAD10.1
  Bottom 0.8: 85.99,52.2 85.99,52.3 C26.2
  Bottom 1.905: 85.99,52.3 86.1,52.3 86.1,52.13
  other vias: 89.26,44.17 80.3,29.16 74.82,25.87 91.85,35.73 90.68,40.37 75.84,38.37 25.28,42.69 37.79,44.85 43.28,39.42 70.46,49.01 84.69,49.48 60.34,49.2 57.76,49.2 55.22,49.21 52.7,49.21 69.24,49.2 68.01,49.2 66.78,49.18 71.78,49.15 73.18,49.16 74.7,49.11 53.99,49.2 56.49,49.03 59.05,49.2 61.59,49.18 51.4,49.19 80.64,49.3 81.78,49.3 88.27,49.3 13.82,56.64 2.51,56.57 5.95,56.59 2.51,45.14 7.3,45 10.13,42.6 21.25,42.67 9.88,37.13 2.51,29.9 8.88,29.75 2.44,2.5 20.19,37.07 25.85,36.79 31.72,21.01 33.07,27.61 26.1,24.38 21.18,28.22 25.59,28.28 43.34,30.92 48.54,30.77 48.37,42.03 54.57,35.62 66.19,38.3 79.56,44.04 75.75,44.06 66.5,44.19 61.52,44.18 83.75,35.26 91.58,2.49 92.01,15.04 88.93,28.09 42.55,2.31 19.68,2.31 60.93,16.96 66.22,18.73 50.02,14.84 73.36,15.62 80.33,19.8 66.21,22.45 61.41,25.61 38.61,9.35 18.81,12.4 13.34,12.47 11.56,25.73 87.71,19.52 80.59,40.41 56.15,38.54 58.38,38.52 66.53,42.07 61.56,42.1 44.42,43.87 41.42,47.36 87,49.3 91.18,49.58 27.99,47.22 10.68,48.27 15.56,54.59 18.03,54.53 79.19,36.54 26.63,12.81 34.18,9.29 40.64,27.94 26.62,5.01 59.9,35.5 66.55,33.03 35.3,21.18 48.36,26.78 50.44,7.59 26.63,16.62 52.46,44 61.81,35.08 61.44,38.16 58.7,21.74 33.07,31.42 76.56,31.75 91.12,52.76 12.64,19.45 49.69,26.79
  pour Top: 0,0 93.98,0 93.98,53.34 48.26,53.34 48.26,50.8 20.32,50.8 20.32,57.15 0,57.15
  pour Bottom: 21.59,69.85 0,69.85 0,0 93.98,0 93.98,53.34 48.26,53.34 48.26,50.8 21.59,50.8
PGOOD_3V  (via drill 0.2 pad 0.61)
  Top 0.152: IC1.6 53.72,61.03 54.37,60.38 v54.37,59.52 | 72.98,62.48 U$2.P$20
  Top 0.406: v72.27,61.77 72.98,62.48 | 3,3V.C 16.09,64.99 16.34,64.75 v21.97,64.75
  Bottom 0.152: 48.6,59.52 46.66,61.46 38.73,61.46 37.8,62.39 34.73,62.39 33.13,63.99 30.94,63.99 30.04,63.09 22.92,63.09 21.97,64.04 | v54.37,59.52 54.44,59.59 61.08,59.59 61.2,59.46 69.97,59.46
  Bottom 0.406: 48.6,59.52 v54.37,59.52 | v21.97,64.75 21.97,64.04 | 69.97,59.46 v72.27,61.77
PGOOD_5V  (via drill 0.2 pad 0.61, 0.4 pad 0.61)
  Top 0.152: 50.82,66.83 49.36,65.37 49.36,64.18 48.34,63.15 48.34,61.34 48.49,61.19 51.04,61.19 51.99,60.23 IC1.7 | U$2.P$5 80.6,62.48 81,62.88
  Top 0.305: v50.84,68.81 50.82,66.83 | 5V.C 10.99,64.99 11.87,65.99 21.11,65.98
  Top 0.406: v82.4,62.88 81,62.88 | 21.11,65.98 21.6,66.62 24.13,66.62 v24.5,66.5
  Bottom 0.152: 50.82,69.66 50.68,69.81 27.77,69.81 v24.5,66.5 | 86.69,62.88 86.75,62.95 87.88,64.07 87.88,67.98 87.75,68.12 83.61,68.12 | 52.99,71.83 79.9,71.83
  Bottom 0.2: v82.4,62.88 82.4,62.8 86.7,62.8 86.8,62.9 86.75,62.95
  Bottom 0.305: v50.84,68.81 50.82,69.66 52.99,71.83
  Bottom 0.406: 79.9,71.83 83.61,68.12
PGOOD_12V1  (via drill 0.2 pad 0.61)
  Top 0.152: v35.78,63.52 35.78,63.51 | v54.31,63.38 54.31,63.79 56.18,65.66 59.15,65.66 IC1.26
  Top 0.254: 35.78,63.51 35.22,62.95 U$1.P$5
  Top 0.305: 10.51,62.95 8.45,64.99 12V1.C | 21.88,62.95 21.88,63 v22.86,63.97
  Top 0.406: 10.51,62.95 21.88,62.95
  Bottom 0.152: 34.7,64.6 30.69,64.6 30.35,64.26 23.14,64.26 v22.86,63.97 | 44.76,63.52 45.33,62.94 53.88,62.94 v54.31,63.38
  Bottom 0.254: 34.7,64.6 v35.78,63.52
  Bottom 0.406: v35.78,63.52 44.76,63.52
PGOOD_12V2  (via drill 0.12, 0.2 pad 0.61)
  Top 0.152: 27.68,64.23 28.96,62.96 28.96,62.95 | 5.91,64.99 5.96,65.04
  Top 0.2: U$1.P$20 29.5,63 29,63 28.96,62.96
  Top 0.406: v27.69,64.77 27.68,64.23 | 12V2.C 5.91,64.99 | 5.96,65.04 v6.25,65.04
  Bottom 0.152: IC1.25 59.4,65.97 51.64,65.97 48.11,69.5 30.55,69.5 27.68,66.63 | 12.93,65.28 27.68,65.28 | v6.25,65.04 6.33,64.96
  Bottom 0.406: 27.68,66.63 27.68,65.28 v27.69,64.77 | 12.93,65.28 12.61,64.96 6.33,64.96
  other vias: 59.95,66.52
PGOOD_ATX  (via drill 0.2 pad 0.61)
  Top 0.508: IC1.14 58.35,56.79 60.95,56.79 61.12,56.96 R22.2 62.25,56.74 v62.25,56.33
  Bottom 0.508: PAD106.1 71.4,10.54 64.22,17.71 64.22,49.75 63.25,50.72 63.25,55.33 v62.25,56.33
RD+
  Top 0.152: 56.75,68.9 R7.1
  Top 0.406: IC1.29 56.75,68.9
RD-
  Top 0.152: 55.88,68.32 55.95,68.25
  Top 0.406: R9.1 55.88,68.32 | 55.95,68.25 IC1.30
RESET2  (via drill 0.2 pad 0.61)
  Top 0.152: IC1.24 60.58,65.03 60.55,65 | 63.24,66.04 R18.1 | 62.31,65.03 62.31,65.11 | S1.4 44.08,68.34 v44.4,68.66
  Top 0.2: 41.13,68.64 41.2,68.7 41.8,68.7 41.91,68.64
  Top 0.254: S1.3 40.88,68.34 40.88,68.39 41.13,68.64 | S1.4 42.21,68.34 41.91,68.64
  Top 0.305: v56.28,65 60.55,65
  Top 0.406: IC1.24 62.31,65.03 | 62.31,65.11 63.24,66.04
  Bottom 0.152: v56.28,65 55.98,65.31 47.75,65.31 v44.4,68.66
SCK  (via drill 0.2 pad 0.61)
  Top 0.152: IC1.15 59.15,58.8 59.09,58.86
  Top 0.305: 59.09,58.86 v59.09,61.43
  Bottom 0.152: JP1.1 63.5,68.75 59.09,64.33 v59.09,61.43
SW1_A
  Top 0.152: 80.27,58.24 80.27,57.27 79.85,56.85 79.35,56.85 78.99,56.49 78.99,56.14 79.33,55.79 80.55,55.79 | 80.27,58.24 79.94,58.24 79.94,58.48 79.31,59.1 79.22,59.1 U$2.P$32 | 80.27,58.24 C22.2 | 83,46.88 83,46.99
  Top 0.406: SJ108.1 83,46.88 | 83,46.99 83,53.34 82.77,53.56 | 82.77,53.56 80.55,55.79 | R31.2 83.91,54.7 82.77,53.56
SW1_B  (via drill 0.2 pad 0.61, 0.4 pad 0.61)
  Top 0.152: 40.43,58.14 35.93,58.13 35.56,58.42 C20.2 35.24,58.62 34.78,58.62 34.78,59.27 | 42.1,58.24 v45.03,58.24
  Top 0.254: 41.19,59.14 41.19,60.21 40.88,60.52 R36.2 | 40.43,58.14 41.19,59.14 | 41.19,59.14 42.1,58.24 | U$1.P$32 34.78,59.27
  Top 0.406: v49.66,45.83 54.97,45.83 SJ109.1
  Bottom 0.406: v45.03,58.24 45.03,50.41 v49.66,45.83
SW2_A  (via drill 0.2 pad 0.61)
  Top 0.152: 71.07,59.57 R32.2 | U$2.P$25 75.72,59.1 75.6,59.1 74.97,58.47 74.97,58.2
  Top 0.406: v77,48.23 75.66,46.89 73.01,46.89 SJ110.1 | 71.07,59.57 72.44,58.2 C21.2 74.97,58.2
  Bottom 0.152: C21.2 74.67,58.2 76.09,56.77 76.09,49.13
  Bottom 0.406: v77,48.23 76.09,49.13
  other vias: 74.34,58.2
SW2_B  (via drill 0.2 pad 0.61)
  Top 0.152: 29.67,58.65 29.67,58.87 30.34,59.55 U$1.P$25 | v26.17,55 26.15,55.42 26.15,58.67 R10.2
  Top 0.406: 26.15,58.67 28.41,58.65 C12.2 29.67,58.65
  Bottom 0.152: SJ116.1 25.29,45.72 | 26.17,46.6 v26.17,55
  Bottom 0.406: 25.29,45.72 26.17,46.6
USBVCC  (via drill 0.2 pad 0.61)
  Bottom 0.152: X2.VBUS 82.79,67.64 78.91,71.53 60.15,71.53 IC1.31
  other vias: 55.15,66.52
VBAT  (via drill 1.2 pad 0.61, 1.4 pad 1.8)
  Top 1.905: 79.36,52.14 U$105.5 | 36.51,52.43 36.52,52.43 v36.52,52.31 | 67.88,52.1 v67.92,52.14 | 51.46,52.1 U$101.5 | 29,52.49 v29.15,52.34 | 35.79,52.76 40.15,52.39 | F100.2 33.59,52.76 | v55.27,52.09 55.3,52.1 54.13,52.1 | v65.63,52.14 65.7,52.2 65.7,52.1
  Top 3.81: v67.92,52.14 79.36,52.14 | 67.88,52.1 65.7,52.1 54.13,52.1 51.46,52.1 37.23,52.1 36.51,52.43 35.79,52.76 33.59,52.76 | F100.2 29.27,52.76 29,52.49 27.37,50.86 v13.34,50.86
  Bottom 0.508: 37.51,52.18 38.1,52.1 R100.1
  Bottom 0.6: 66.52,52.13 U$108.5
  Bottom 0.8: C25.2 13.35,53.02 13.34,53.02 v13.34,50.86 | C26.1 84.19,52.95 83.42,52.95 83.2,52.72 | 83.19,52.38 83.2,52.38
  Bottom 0.813: 67.94,54.61 67.97,54.81
  Bottom 1.016: 67.97,54.81 SJ104.2
  Bottom 1.905: U$104.5 10.18,51.73 U$104.6 U$104.7 v13.34,50.86 | U$108.7 67.93,52.14 v67.92,52.14 66.69,52.14 U$108.6 66.52,52.13 | SJ103.1 49.72,52.13 U$101.5 U$101.6 U$101.7 U$101.8 | U$108.7 67.94,54.61 | U$108.7 U$108.8 | 37.51,52.18 36.65,52.18 v36.52,52.31 | U$105.5 U$105.6 U$105.7 U$105.8 83.19,52.38 | 83.2,52.38 83.2,52.72
  Bottom 3.81: 10.18,51.73 C114.+
  other vias: 51.44,52.13 79.38,52.13
VIN_5VSTBY  (via drill 0.4 pad 0.61)
  Top 0.508: 46.35,22.76 46.62,23.02 | 51.33,28.5 C100.+ | R41.2 46.65,23.9
  Top 0.813: 46.62,23.02 R41.2 | U$3.2 46.35,22.76 | 47.53,28.5 46.65,26.89 46.65,23.9 | 47.53,28.5 51.33,28.5 | 47.53,28.5 v45.48,30.78
  Bottom 0.508: R100.2 38.92,46.75 45.51,40.16 v45.48,30.78
VIN_A  (via drill 0.2 pad 0.61)
  Top 0.152: v73.12,60.14 73.5,60.14 74.34,60.98 U$2.P$23
  Bottom 0.152: v73.12,60.14 70.57,57.58 SJ104.1
VIN_B  (via drill 0.12, 0.2 pad 0.61)
  Top 0.152: 28.96,61.45 28.52,61.01 28.52,60.32 29.18,59.66 v29.71,59.66 | v33.13,56.57 33.51,56.2 45.23,56.21 v46.86,54.54
  Top 0.254: 28.96,61.45 U$1.P$23
  Bottom 0.152: v46.86,54.54 46.86,54.36 SJ103.2 | v29.71,59.66 30.04,59.66 v33.13,56.57
VREF2_A
  Top 0.152: 79.34,62.98 79.34,63.18 78.42,64.1 77.22,64.1 76.5,64.1 75.6,63.2 75.6,62.98 | 80.36,69.47 80.34,69.45 C30.2 79.78,70.08 79.69,70.08 79.64,70.13 | R39.1 73.75,70.11 79.63,70.11 79.64,70.13 | U$2.P$13 77.22,65.36 77.17,65.41 77.17,65.88 76.15,66.91 | 79.64,70.13 C14.1
  Top 0.254: 79.34,62.98 U$2.P$6 | 77.22,64.1 U$2.P$13 | U$2.P$19 75.6,62.98 | 76.15,66.91 75.38,66.91 75.23,67.05 C29.2 75.3,67.68 76.2,68.58 78.91,68.58 C30.2
  Top 0.406: 80.36,69.47 R23.2
VREF2_B
  Top 0.152: 31.84,64.57 33.06,64.57 33.97,63.67 33.97,63.45 U$1.P$6 | 31.84,64.57 31.84,64.65 | 30.22,63.45 30.22,63.67 31.13,64.57 31.84,64.57 | 31.84,66.14 32.99,67.28 32.99,67.72 33.4,68.13 33.97,68.13 34.34,67.76 34.83,67.76 35.92,68.85 35.92,70.41 | 38.49,67.19 37.82,67.86 37.82,69.76 37.04,70.55 36.81,70.55 36.81,70.59 | C32.2 35.05,70.71 30.15,70.71 C31.2 30.12,71.3
  Top 0.254: 31.84,64.65 U$1.P$13 31.84,66.14 | U$1.P$19 30.22,63.45 | 36.81,70.55 36.05,70.55 35.92,70.41
  Top 0.406: 38.49,67.19 C5.1 | 30.12,71.3 R27.1 | C32.2 36.79,71.24 R17.2 36.81,70.59
VREG3_A
  Top 0.152: 69.62,61.08 C17.2 | 74.34,61.48 U$2.P$22 | IC1.4 53.72,62.63 53.72,65.03 54.35,65.66 IC1.32 54.35,67.39 54.31,67.43 | 54.37,70.35 54.31,70.3 | 63.05,67.39 R18.2
  Top 0.2: 54.31,70 54.4,70 54.41,69.84 | C3.1 53.7,70.4 53.7,70.8 53.5,71 53.34,71.12 | 69.62,65.16 69.6,65.3 68.8,66.1 68.74,66.04 | C17.2 69.7,62 70.5,61.2 72.3,61.2 72.8,60.7 73.5,60.7 74.3,61.5 74.34,61.48
  Top 0.254: C3.1 54.37,70.35 | 54.31,68.64 C1.1 | 54.31,68.64 54.31,67.43 | 54.31,70.3 54.31,70 54.31,68.64
  Top 0.305: 69.62,65.16 69.62,61.08 | R18.2 68.74,66.04
  Top 0.406: 58.35,69.22 58.13,69.36 57.32,69.84 54.41,69.84 | 58.35,69.22 IC1.27 | R16.2 49.18,62.49 49.32,62.63 IC1.4 | 63.05,67.39 62.11,67.39 60.25,69.25 58.38,69.25 58.35,69.22 | R2.1 2.54,72.39 12.72,72.39 | 12.72,72.39 R12.1 | 12.72,72.39 24.89,72.39 25.55,73.05 51.41,73.05 53.34,71.12
VREG3_B
  Top 0.2: 25.09,60.41 24.7,60.8 C9.2 | 28.96,61.95 28.9,61.9 28.8,61.9 27.5,60.6 27.5,60.2 27.1,59.8 27.1,59.76
  Top 0.254: 28.96,61.95 U$1.P$22 | 27.19,59.76 27.1,59.76 25.74,59.76 25.09,60.41
VREG5_A  (via drill 0.2, 0.2 pad 0.61)
  Top 0.152: U$2.P$29 77.72,59.1 77.83,58.99 77.83,56.98 77.31,56.45 70.04,56.45 | 15.25,70.02 R1.1
  Top 0.2: v28.6,66.7 28,67.3 27.88,67.37
  Top 0.305: v64.48,60.03 65.38,59.23 66.08,59.23 67.12,58.09 67.12,57.31 C24.2 | 15.25,70.02 15.11,69.78 11.71,69.78
  Top 0.406: C24.2 69.18,57.31 70.04,56.45 | 27.88,67.37 20.96,67.37 18.1,70.02 15.25,70.02 | 11.71,69.78 10.99,70.75 R3.1
  Bottom 0.152: 28.86,67.04 31.03,69.2 37.38,69.2 39.04,67.53 45.08,67.53 47.6,65 54.66,65 59.16,60.5 62.67,60.5 62.79,60.62 63.89,60.62
  Bottom 0.2: v28.6,66.7 28.9,67 28.86,67.04
  Bottom 0.305: 63.89,60.62 v64.48,60.03
VREG5_B
  Top 0.152: 30.59,56.2 32.34,57.95 | 9.61,61.48 6.79,64.3 6.79,69.45 6.78,69.9 6.78,69.92 | 7.46,70.12 7.62,70.12
  Top 0.2: 24.7,57.3 C4.2 | 6.8,70.05 6.8,69.9 6.78,69.9
  Top 0.254: 32.34,57.95 U$1.P$29
  Top 0.406: R5.1 5.91,70.75 5.91,70.72 6.58,70.05 6.8,70.05 7.39,70.05 7.46,70.12 | 7.62,70.12 R4.1 | 24.8,53.98 26.43,53.98
  Top 0.61: 30.59,56.2 28.65,56.2 26.43,53.98 24.7,53.98 24.7,57.3 | 9.61,61.48 18.14,61.48 20.15,59.47 20.15,55.03 21.2,53.98 24.8,53.98
XT1
  Top 0.152: 48.05,67.11 Y1.3
  Top 0.305: R13.2 48.63,65.6 48.66,65.63
  Top 0.406: Y1.3 48.66,65.63 | 48.05,67.11 47.13,67.11 46.56,67.68 R15.1
XT2
  Top 0.152: IC1.1 51.99,65.03 51.99,65.51 52.52,66.04 52.52,69.41 52.41,69.53 50.77,69.53 50.19,70.11 | Y1.1 47.9,70.11 | 47.13,70.11 47.13,70.06
  Top 0.406: 50.19,70.11 Y1.1 | 47.9,70.11 47.13,70.11 | R15.2 46.55,69.48 47.13,70.06
~POWER_ON  (via drill 0.2 pad 0.61, 0.4 pad 0.61)
  Top 0.508: IC1.9 54.35,55.75 v54.39,55.71 | v60.37,13.69 57.77,13.69 R38.2 54.61,9.62 54.59,9.6 PAD7.1
  Bottom 0.508: v54.39,55.71 60.22,55.71 60.4,55.6 60.6,55.4 60.7,55.4 62.3,53.8 62.3,53.6 62.49,53.44 62.49,50.41 63.46,49.44 63.46,16.78 63.4,16.6 60.5,13.7 60.4,13.7 v60.37,13.69

## Text on the board
tPlace: +3V3 | +12V2 | +5V | +12V1 | +12V1 | +5V | +12V1 | +3V3 | +12V1